# EasyEDA Pro project ProPrj_STM32F405RGT6机器人主控板_2024-12-01.epro, board PCB1
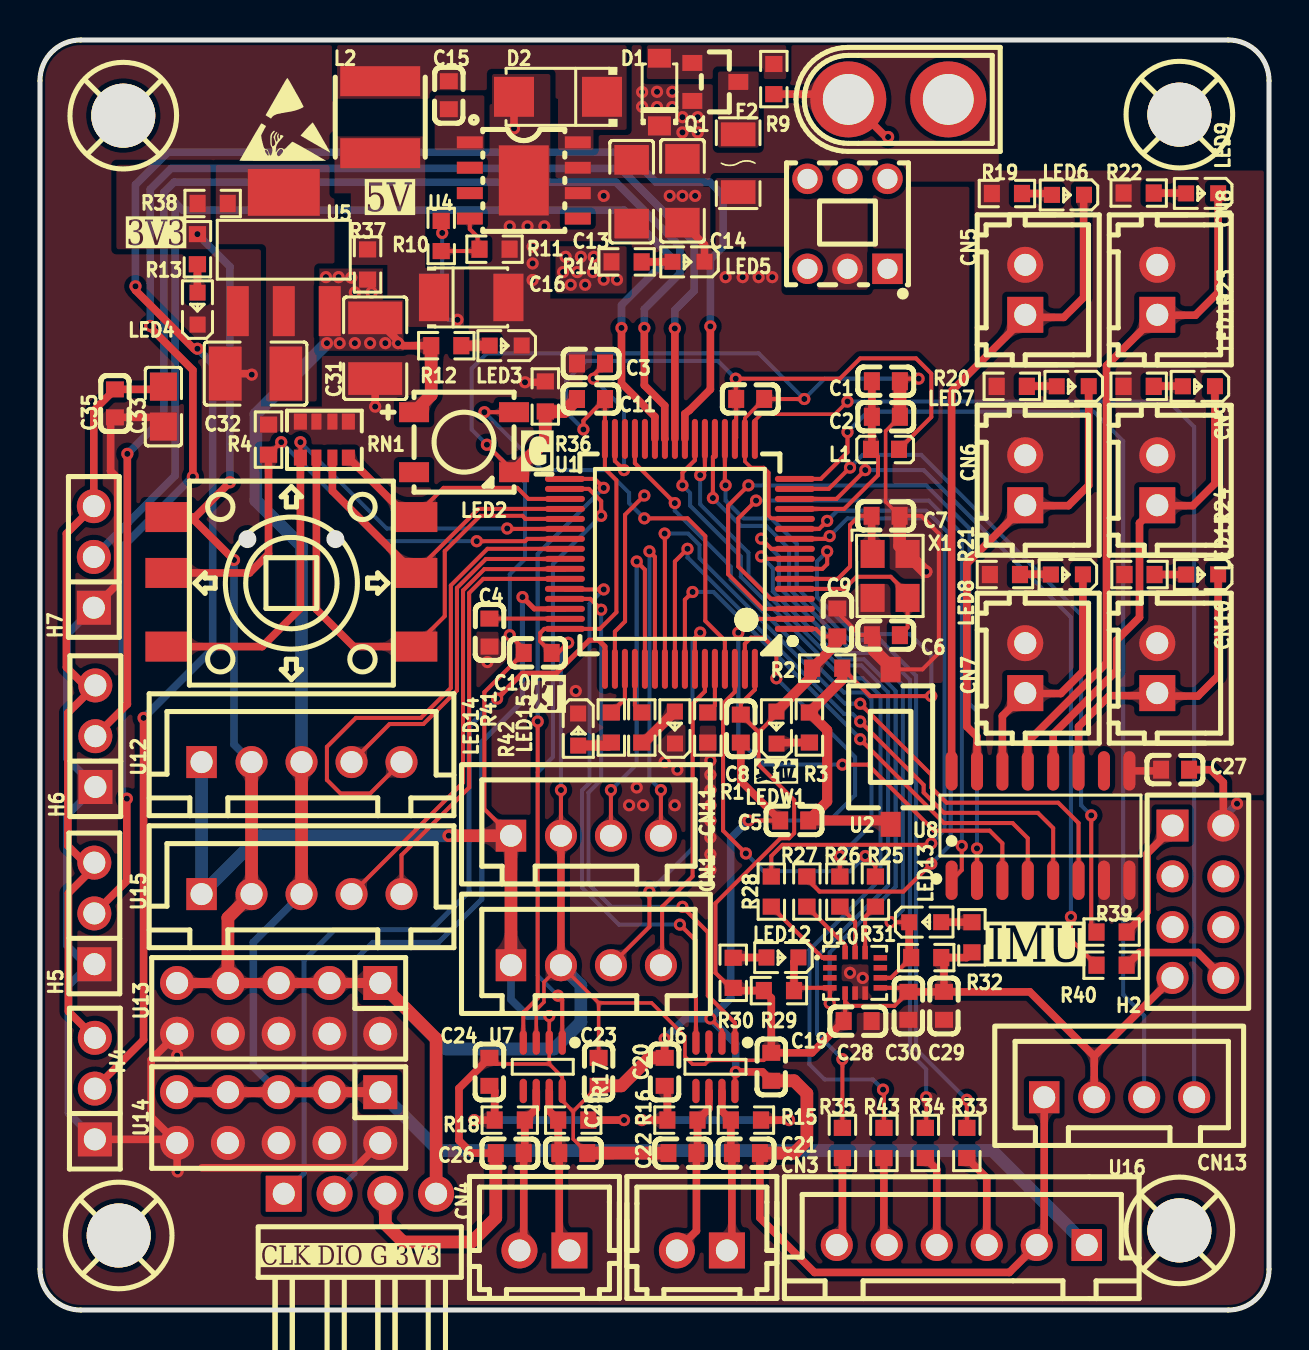
[diagram p3: board, top side]
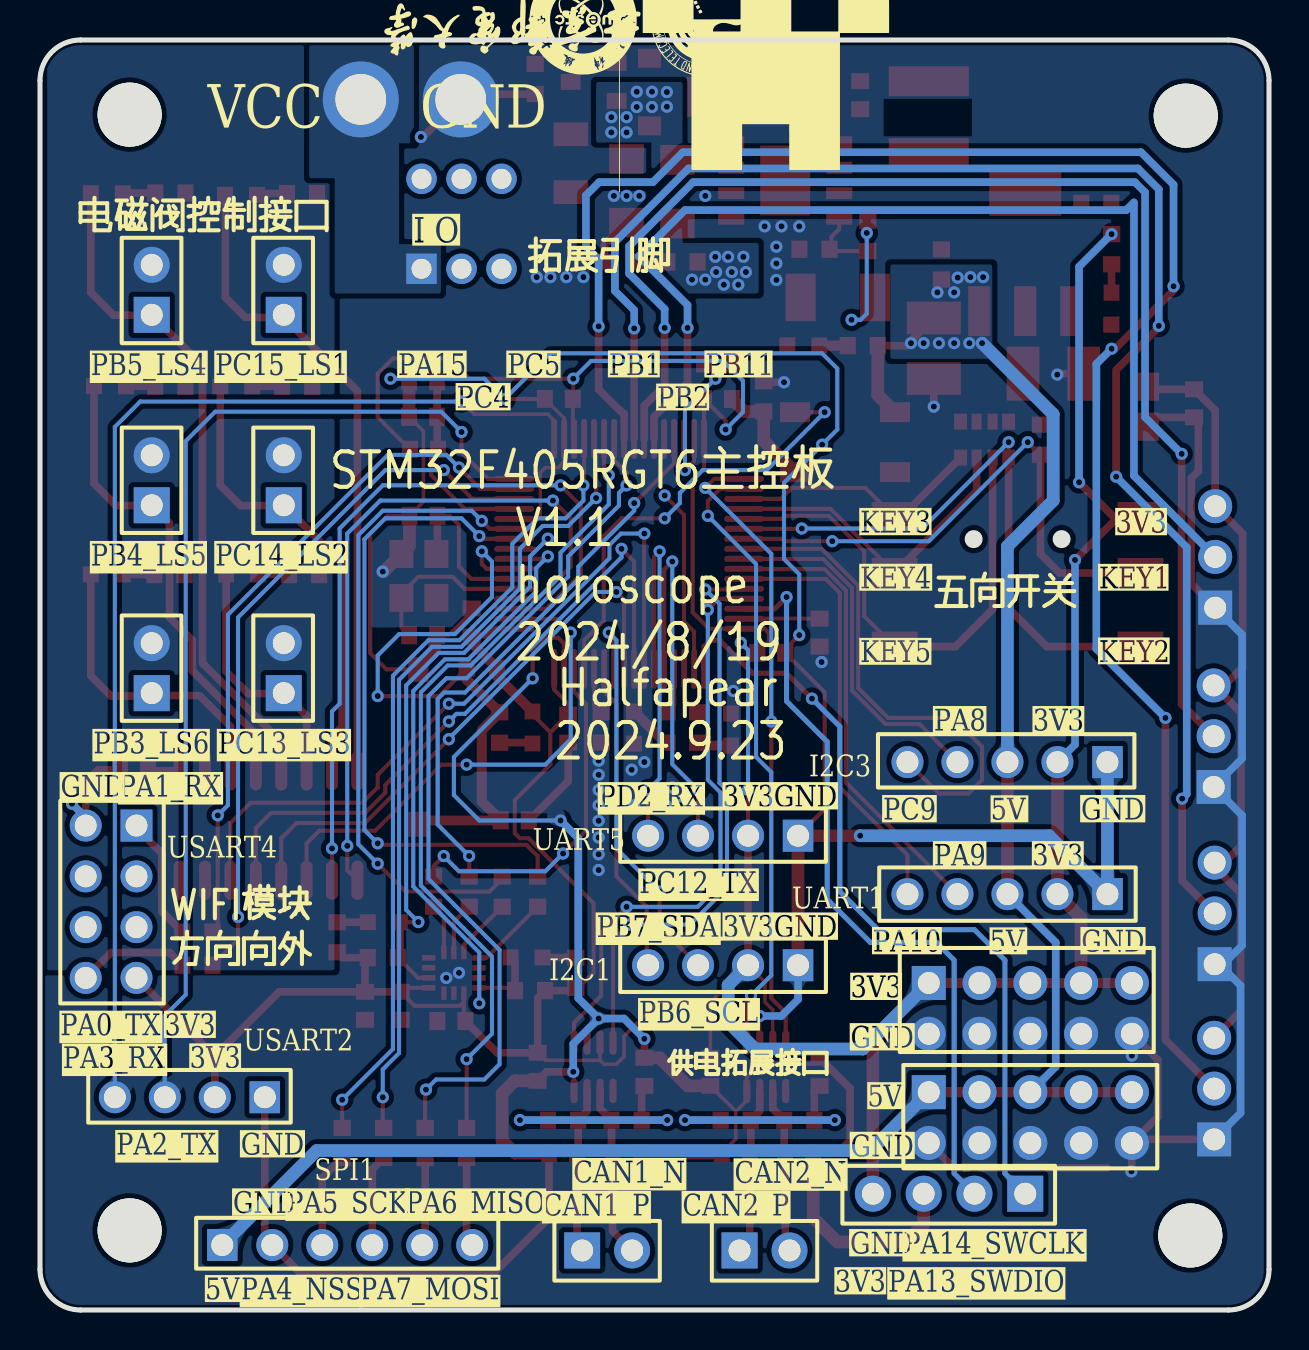
[diagram p4: board, bottom side, seen from below]

Outline 61.47 x 63.53 mm; copper layers: Top Layer, Bottom Layer. Coordinates in mm from the lower left corner of the outline.
Outline path: 0,61.49 0,2.03 arc(0.6,0.6) 2.03,0 59.44,0 arc(60.87,0.6) 61.47,2.03 61.47,61.49 arc(60.87,62.93) 59.44,63.53 2.03,63.53 arc(0.6,62.93) 0,61.49
Stack: Top Layer 0.035mm / Dielectric1 1.51mm FR4 er 4.5 / Bottom Layer 0.035mm

## Design rules (mm)
template: 自定义配置
spacing copperThickness1oz (default): track to track 0.102, other pairs 0.152 to 0.3
spacing copperThickness2oz: track to track 0.203, other pairs 0.152 to 0.3
track width copperThickness1oz (default): min 0.127, default 0.254, max 2.54
track width copperThickness2oz: min 0.203, default 0.254, max 2.54
differential pair differentialPair (default): width min 0.127, default 0.254, max 2.54; gap min 0.152, default 0.152
via viaSize (default): diameter min 0.5, default 0.61, max 10; hole min 0.3, default 0.305, max 6.299
net AGND uses copperRegion1
net 3V3 uses copperRegion1
net GND uses copperRegion1
net +5V uses copperRegion1
net VIN uses copperRegion1
net $2N592 uses copperRegion1
net VOUT uses copperRegion1
net $2N681 uses copperRegion1
net $2N1442 uses copperRegion1
net $2N1785 uses copperRegion1
net $2N1445 uses copperRegion1
net $2N1741 uses copperRegion1
net $2N2095 uses copperRegion1
net $2N9009 uses copperRegion1

## Placement (name value [footprint] x y rotation side)
C1  10nF  [C0603]  42.31 46.46 0 top
C2  1uF  [C0603]  42.31 44.68 0 top
C3  2.2uF  [C0603]  27.56 47.35 180 top
C4  2.2uF  [C0603]  22.48 33.88 270 top
C5  100nF  [C0603]  37.72 24.49 0 top
C6  22pF  [C0603]  42.31 33.76 0 top
C7  22pF  [C0603]  42.29 39.73 180 top
C8  100nF  [C0603]  35.05 29.08 90 top
C9  100nF  [C0603]  39.88 34.39 270 top
C10  100nF  [C0603]  24.89 32.87 0 top
C11  100nF  [C0603]  27.56 45.57 0 top
C12  100nF  [C0603]  35.52 45.57 180 top
C13  4.7uF  [C1206]  29.59 55.94 90 top
C14  4.7uF  [C1206]  32.13 55.98 90 top
C15  10nF  [C0603]  20.45 60.76 90 top
C16  220uF  [CASE-B_3528]  21.56 50.65 0 top
C19  100nF  [C0603]  36.58 12.17 90 top
C20  4.7nF  [C0603]  31.24 11.91 90 top
C21  100pF  [C0603]  35.31 7.85 180 top
C22  100pF  [C0603]  32.13 7.85 180 top
C23  100nF  [C0603]  27.94 11.91 90 top
C24  4.7nF  [C0603]  22.48 11.91 90 top
C25  100pF  [C0603]  26.67 7.85 180 top
C26  100pF  [C0603]  23.5 7.85 180 top
C27  100nF  [C0603]  56.77 27.03 0 top
C28  100nF  [C0603]  40.89 14.45 180 top
C29  2.2uF  [C0603]  45.21 15.21 90 top
C30  10nF  [C0603]  43.43 15.21 90 top
C31  10uF  [C1210]  16.76 48.11 90 top
C32  10uF  [C1210]  10.78 46.84 0 top
C33  100nF  [C0805]  6.17 45.19 90 top
C35  1uF  [C0603]  3.75 45.35 90 top
CN1  I2C1  [CONN-TH_4P-P2.50_4PIN]  27.31 17.25 0 top
CN2  XT30U-M  [CONN-TH_XT30U-M]  42.93 60.55 180 top
CN3  ZX-XH2.54-2PZZ  [CONN-TH_2P-P2.50_HX25003-2A]  33.1 2.98 180 top
CN4  ZX-XH2.54-2PZZ  [CONN-TH_2P-P2.50_HX25003-2A]  25.23 2.98 180 top
CN5  ZX-XH2.54-2PZZ  [CONN-TH_2P-P2.50_HX25003-2A]  49.28 51.03 90 top
CN6  ZX-XH2.54-2PZZ  [CONN-TH_2P-P2.50_HX25003-2A]  49.28 41.5 90 top
CN7  ZX-XH2.54-2PZZ  [CONN-TH_2P-P2.50_HX25003-2A]  49.28 32.11 90 top
CN8  ZX-XH2.54-2PZZ  [CONN-TH_2P-P2.50_HX25003-2A]  55.88 51.03 90 top
CN9  ZX-XH2.54-2PZZ  [CONN-TH_2P-P2.50_HX25003-2A]  55.88 41.5 90 top
CN10  ZX-XH2.54-2PZZ  [CONN-TH_2P-P2.50_HX25003-2A]  55.88 32.11 90 top
CN11  UART5  [CONN-TH_4P-P2.50_4PIN]  27.31 23.72 0 top
CN13  UART2  [CONN-TH_4P-P2.50_4PIN]  53.97 10.64 0 top
D1  MM1Z5V1  [SOD-123_L2.8-W1.8-LS3.7-RD]  30.98 60.92 90 top
D2  B340A  [SMA_L4.3-W2.6-LS5.1-RD]  25.91 60.68 180 top
F2  MF-NSMF020-2  [F1206]  34.92 57.36 90 top
H1  2.54-1*4P反弯排针  [HDR-TH_4P-P2.54-H-M-W10.4]  16 5.82 0 top
H2  PM254V-12-08-H85  [HDR-TH_8P-P2.54-V-F-R2-C4-S2.54]  57.91 20.42 270 top
H4  PZ254V-11-03P  [HDR-TH_3P-P2.54-V-M]  2.74 11.07 90 top
H5  PZ254V-11-03P  [HDR-TH_3P-P2.54-V-M]  2.72 19.84 90 top
H6  PZ254V-11-03P  [HDR-TH_3P-P2.54-V-M]  2.77 28.7 90 top
H7  PZ254V-11-03P  [HDR-TH_3P-P2.54-V-M]  2.69 37.67 90 top
L1  120R@100MHz  [L0603]  42.26 43.05 180 top
L2  22uH  [IND-SMD_L4.0-W4.0_LQH44PN2R2MP0L]  17.02 59.66 270 top
LED2  WS2812B  [LED-SMD_4P-L5.0-W5.0-BL_XL-5050RGBC]  21.21 43.41 270 top
LED3  -  [LED_0603]  23.24 48.23 180 top
LED4  -  [LED_0603]  7.87 50.14 90 top
LED5  -  [LED_0603]  32.38 52.43 180 top
LED6  -  [LED_0603]  51.36 55.77 180 top
LED7  -  [LED_0603]  51.6 46.2 180 top
LED8  -  [LED_0603]  51.31 36.78 180 top
LED9  -  [LED_0603]  58.07 55.85 180 top
LED10  -  [LED_0603]  57.91 46.2 180 top
LED11  -  [LED_0603]  58.07 36.78 180 top
LED12  -  [LED_0603]  37.08 17.63 180 top
LED13  -  [LED_0603]  44.32 19.41 0 top
LED14  -  [LED_0603]  26.92 28.98 270 top
LED15  -  [LED_0603]  31.75 29.18 90 top
LEDW1  -  [LED_0603]  36.83 29.18 90 top
Q1  AO3401A  [SOT-23_L2.9-W1.3-P1.90-LS2.4-BR]  33.78 61.43 180 top
R1  100K  [R0603]  33.4 29.14 270 top
R2  10K  [R0603]  39.37 32.11 180 top
R3  1K  [R0603]  38.48 29.14 270 top
R4  100K  [R0603]  11.43 43.54 270 top
R9  10K  [R0603]  36.7 61.57 90 top
R10  10K  [R0603]  20.07 53.72 90 top
R11  3.24K  [R0603]  22.73 53.06 0 top
R12  2K  [R0603]  20.32 48.23 0 top
R13  1K  [R0603]  7.87 53.06 270 top
R14  10K  [R0603]  29.34 52.43 0 top
R15  60R  [R0603]  35.31 9.5 0 top
R16  60R  [R0603]  32.13 9.5 180 top
R17  60R  [R0603]  26.67 9.5 0 top
R18  60R  [R0603]  23.5 9.5 180 top
R19  20K  [R0603]  48.36 55.85 0 top
R20  20K  [R0603]  48.6 46.2 0 top
R21  20K  [R0603]  48.26 36.79 0 top
R22  20K  [R0603]  54.95 55.87 0 top
R23  20K  [R0603]  54.95 46.2 0 top
R24  20K  [R0603]  54.99 36.79 0 top
R25  22R  [R0603]  41.78 20.93 270 top
R26  22R  [R0603]  40 20.93 270 top
R27  22R  [R0603]  38.35 20.93 270 top
R28  22R  [R0603]  36.58 20.93 270 top
R29  10K  [R0603]  36.96 15.98 0 top
R30  1K  [R0603]  34.67 16.87 90 top
R31  10K  [R0603]  44.32 17.63 180 top
R32  1K  [R0603]  46.61 18.64 90 top
R33  22R  [R0603]  46.35 8.36 90 top
R34  22R  [R0603]  44.28 8.36 90 top
R35  22R  [R0603]  40.13 8.36 90 top
R36  0R  [R0603]  25.27 45.69 270 top
R37  0R  [R0603]  16.38 52.3 270 top
R38  0R  [R0603]  8.64 55.35 180 top
R39  0R  [R0603]  53.59 18.91 0 top
R40  0R  [R0603]  53.59 17.25 180 top
R41  10K  [R0603]  28.57 29.14 270 top
R42  10K  [R0603]  30.1 29.14 270 top
R43  22R  [R0603]  42.21 8.36 90 top
RN1  100kΩ  [RES-ARRAY-SMD_0603-8P-L3.2-W1.6-BL]  14.22 43.54 180 top
SCREW1  -  [M3螺丝]  4 3.66 0 top
SCREW2  -  [M3螺丝]  4.23 59.68 0 top
SCREW3  -  [M3螺丝]  57.05 3.92 0 top
SCREW4  -  [M3螺丝]  57.05 59.73 0 top
SW2  五向开关  [SW-SMD_K1-1504SA-06]  12.57 36.42 0 top
SW3  5.8 ZSGT  [SW-TH_5.8ZSGT]  40.39 54.33 0 top
U1  STM32F405RGT6  [LQFP-64_L10.0-W10.0-P0.50-LS12.0-BL]  32 37.82 90 top
U2  GT-TC060A-H025-L1  [SW-SMD_L6.1-W3.5-LS8.0]  42.54 28.17 90 top
U4  TPS5430DDAR  [ESOP-8_L4.9-W3.9-P1.27-LS6.0-TL-EP]  24.2 56.5 0 top
U5  AMS1117-3.3  [SOT-223-3_L6.5-W3.4-P2.30-LS7.0-BR]  12.19 52.93 270 top
U6  MAX3051EKA+T  [SOT-23-8_L3.0-W1.7-P0.65-LS2.8-TL]  33.78 12.17 270 top
U7  MAX3051EKA+T  [SOT-23-8_L3.0-W1.7-P0.65-LS2.8-TL]  25.15 12.17 270 top
U8  ULN2003D1013TR  [SOIC-16_L9.9-W3.9-P1.27-LS6.0-BL]  50.04 24.23 0 top
U10  ICM-42688-P  [LGA-14_L3.0-W2.5-P0.50-TL]  40.77 16.87 0 top
U12  I2C3  [CONN-TH_5P-P2.50_ZX-XH2.54-5PZZ]  13.08 27.41 0 top
U13  ZX-PZ2.54-2-5PZZ  [HDR-TH_10P-P2.54-V-M-R2-C5-S2.54]  11.94 15.09 180 top
U14  ZX-PZ2.54-2-5PZZ  [HDR-TH_10P-P2.54-V-M-R2-C5-S2.54]  11.94 9.63 180 top
U15  I2C3  [CONN-TH_5P-P2.50_ZX-XH2.54-5PZZ]  13.08 20.8 0 top
U16  SPI1  [CONN-TH_6P-P2.50_ZX-XH2.54-6PZZ]  46.1 3.25 0 top
X1  25MHz  [OSC-SMD_4P-L3.2-W2.5-BL]  42.52 36.72 270 top

## Footprints (pads in the part's own frame, mm; a bottom-side part is the same pattern mirrored in y, then rotated)
C0603
  rect 0.8x0.9 smd: 1(-0.7,0) 2(0.7,0)
C0805
  rect 1.41x1.35 smd: 1(-1,0) 2(1,0)
C1206
  rect 1.485x1.728 smd: 1(-1.593,0) 2(1.593,0)
C1210
  rect 1.635x2.7 smd: 1(-1.518,0) 2(1.518,0)
CASE-B_3528
  rect 1.506x2.376 smd: 1(-1.861,0) 2(1.861,0)
CONN-TH_2P-P2.50_HX25003-2A
  rect 1.8x1.8 hole 1.1: 1(-1.25,0)
  round 1.8 hole 1.1: 2(1.25,0)
CONN-TH_4P-P2.50_4PIN
  rect 1.524x1.6 hole 1.1: 1(-3.75,0)
  round 1.6 hole 1.1: 2(-1.25,0) 3(1.25,0) 4(3.75,0)
CONN-TH_5P-P2.50_ZX-XH2.54-5PZZ
  rect 1.524x1.6 hole 1.1: 1(-5,0)
  round 1.6 hole 1.1: 2(-2.5,0) 3(0,0) 4(2.5,0) 5(5,0)
CONN-TH_6P-P2.50_ZX-XH2.54-6PZZ
  rect 1.524x1.6 hole 1.1: 1(6.25,0)
  round 1.6 hole 1.1: 2(3.75,0) 3(1.25,0) 4(-1.25,0) 5(-3.75,0) 6(-6.25,0)
CONN-TH_XT30U-M
  round 3.8 hole 2.54: 1(-2.5,0) 2(2.5,0)
ESOP-8_L4.9-W3.9-P1.27-LS6.0-TL-EP
  rect 1.3x0.6 smd: 1(-2.7,1.905) 2(-2.7,0.635) 3(-2.7,-0.635) 4(-2.7,-1.905) 5(2.7,-1.905) 6(2.7,-0.635) 7(2.7,0.635) 8(2.7,1.905)
  rect 2.5x3.5 smd: 9(0,0)
F1206
  rect 1.19x1.728 smd: 1(-1.445,0) 2(1.445,0)
HDR-TH_3P-P2.54-V-M
  rect 1.7x1.7 hole 1.1: 1(-2.54,0)
  round 1.7 hole 1.1: 2(0,0) 3(2.54,0)
HDR-TH_4P-P2.54-H-M-W10.4
  rect 1.8x1.8 hole 1.1: 1(-3.81,0)
  round 1.8 hole 1.1: 2(-1.27,0) 3(1.27,0) 4(3.81,0)
HDR-TH_8P-P2.54-V-F-R2-C4-S2.54
  rect 1.6x1.6 hole 1.1: 1(-3.81,-1.27)
  round 1.6 hole 1.1: 2(-3.81,1.27) 3(-1.27,-1.27) 4(-1.27,1.27) 5(1.27,-1.27) 6(1.27,1.27) 7(3.81,-1.27) 8(3.81,1.27)
HDR-TH_10P-P2.54-V-M-R2-C5-S2.54
  rect 1.7x1.7 hole 1.1: 1(-5.08,-1.27)
  round 1.7 hole 1.1: 2(-5.08,1.27) 3(-2.54,-1.27) 4(-2.54,1.27) 5(0,-1.27) 6(0,1.27) 7(2.54,-1.27) 8(2.54,1.27) 9(5.08,-1.27) 10(5.08,1.27)
IND-SMD_L4.0-W4.0_LQH44PN2R2MP0L
  rect 1.5x4 smd: 1(-1.8,0) 2(1.8,0)
L0603
  rect 0.8x0.864 smd: 1(-0.7,0) 2(0.7,0)
LED-SMD_4P-L5.0-W5.0-BL_XL-5050RGBC
  rect 1x1.5 smd: 1(-1.5,-2.5) 2(1.5,-2.5) 3(1.5,2.5) 4(-1.5,2.5)
LED_0603
  rect 0.8x0.8 smd: 1(-0.851,-0.01) 2(0.75,-0.005)
LGA-14_L3.0-W2.5-P0.50-TL
  rect 0.675x0.28 smd: 1(-1.262,0.75) 2(-1.262,0.25) 3(-1.262,-0.25) 4(-1.262,-0.75) 8(1.262,-0.75) 9(1.262,-0.25) 10(1.262,0.25) 11(1.262,0.75)
  rect 0.28x0.675 smd: 5(-0.5,-1.012) 6(0,-1.012) 7(0.5,-1.012) 12(0.5,1.012) 13(0,1.012) 14(-0.5,1.012)
LQFP-64_L10.0-W10.0-P0.50-LS12.0-BL
  oval 0.3x2 smd: 1(-3.75,-5.75) 2(-3.25,-5.75) 3(-2.75,-5.75) 4(-2.25,-5.75) 5(-1.75,-5.75) 6(-1.25,-5.75) 7(-0.75,-5.75) 8(-0.25,-5.75) 9(0.25,-5.75) 10(0.75,-5.75) 11(1.25,-5.75) 12(1.75,-5.75) 13(2.25,-5.75) 14(2.75,-5.75) 15(3.25,-5.75) 16(3.75,-5.75) 33(3.75,5.75) 34(3.25,5.75) 35(2.75,5.75) 36(2.25,5.75) 37(1.75,5.75) 38(1.25,5.75) 39(0.75,5.75) 40(0.25,5.75) 41(-0.25,5.75) 42(-0.75,5.75) 43(-1.25,5.75) 44(-1.75,5.75) 45(-2.25,5.75) 46(-2.75,5.75) 47(-3.25,5.75) 48(-3.75,5.75)
  oval 2x0.3 smd: 17(5.75,-3.75) 18(5.75,-3.25) 19(5.75,-2.75) 20(5.75,-2.25) 21(5.75,-1.75) 22(5.75,-1.25) 23(5.75,-0.75) 24(5.75,-0.25) 25(5.75,0.25) 26(5.75,0.75) 27(5.75,1.25) 28(5.75,1.75) 29(5.75,2.25) 30(5.75,2.75) 31(5.75,3.25) 32(5.75,3.75) 49(-5.75,3.75) 50(-5.75,3.25) 51(-5.75,2.75) 52(-5.75,2.25) 53(-5.75,1.75) 54(-5.75,1.25) 55(-5.75,0.75) 56(-5.75,0.25) 57(-5.75,-0.25) 58(-5.75,-0.75) 59(-5.75,-1.25) 60(-5.75,-1.75) 61(-5.75,-2.25) 62(-5.75,-2.75) 63(-5.75,-3.25) 64(-5.75,-3.75)
M3螺丝
  round 3.2 hole 3.2: 1(-0.064,0.064)
OSC-SMD_4P-L3.2-W2.5-BL
  rect 1.4x1.2 smd: 1(-1.1,-0.875) 2(1.1,-0.875) 3(1.1,0.875) 4(-1.1,0.875)
R0603
  rect 0.806x0.864 smd: 1(-0.753,0) 2(0.753,0)
RES-ARRAY-SMD_0603-8P-L3.2-W1.6-BL
  rect 0.65x0.8 smd: 1(-1.2,-0.9) 4(1.2,-0.9) 5(1.2,0.9) 8(-1.2,0.9)
  rect 0.5x0.8 smd: 2(-0.4,-0.9) 3(0.4,-0.9) 6(0.4,0.9) 7(-0.4,0.9)
SMA_L4.3-W2.6-LS5.1-RD
  rect 2x2 smd: 1(-2.2,0) 2(2.2,0)
SOD-123_L2.8-W1.8-LS3.7-RD
  rect 0.95x1.15 smd: 1(-1.692,0) 2(1.692,0)
SOIC-16_L9.9-W3.9-P1.27-LS6.0-BL
  oval 0.602x1.971 smd: 1(-4.445,-2.736) 2(-3.175,-2.736) 3(-1.905,-2.736) 4(-0.635,-2.736) 5(0.635,-2.736) 6(1.905,-2.736) 7(3.175,-2.736) 8(4.445,-2.736) 9(4.445,2.736) 10(3.175,2.736) 11(1.905,2.736) 12(0.635,2.736) 13(-0.635,2.736) 14(-1.905,2.736) 15(-3.175,2.736) 16(-4.445,2.736)
SOT-23-8_L3.0-W1.7-P0.65-LS2.8-TL
  oval 1.222x0.364 smd: 1(-1.211,0.975) 2(-1.211,0.325) 3(-1.211,-0.325) 4(-1.211,-0.975) 5(1.211,-0.975) 6(1.211,-0.325) 7(1.211,0.325) 8(1.211,0.975)
SOT-23_L2.9-W1.3-P1.90-LS2.4-BR
  rect 1x0.8 smd: 1(1.15,-0.95) 2(1.15,0.95) 3(-1.15,0)
SOT-223-3_L6.5-W3.4-P2.30-LS7.0-BR
  rect 2.5x1.1 smd: 1(2.97,-2.3) 2(2.97,0) 3(2.97,2.3)
  rect 2.34x3.6 smd: 4(-2.97,0)
SW-SMD_K1-1504SA-06
  rect 2.3x1.5 smd: 1(-6.15,3.239) 2(-6.15,0.445) 3(-6.15,-3.239) 4(6.15,3.239) 5(6.15,0.445) 6(6.15,-3.239)
SW-SMD_L6.1-W3.5-LS8.0
  rect 1.25x1 smd: 1(-3.875,0) 2(3.875,0)
SW-TH_5.8ZSGT
  rect 1.524x1.524 hole 1: 1(2,-2.25)
  round 1.524 hole 1: 2(0,-2.25) 3(-2,-2.25) 4(2,2.25) 5(0,2.25) 6(-2,2.25)

## Nets
As in the schematic.

Pads without a net: H2 3 4 5 6; LED2 2; SCREW1 1; SCREW2 1; SCREW3 1; SCREW4 1; SW3 3 4 5 6; U4 2 3 5; U6 5; U7 5; U8 10; U10 2 3 10 11

## Via types
v1: diameter 0.61, hole 0.305, Top Layer to Bottom Layer, 175 vias

## Routing (per net, layer and track width the routed paths; a pad name or vN(x,y) marks a point on that pad's centre or on a via; arc(x,y) is an arc through that point)
3.3V: length 39.3
  Top Layer w0.381: H4.3 1.42,14.93 1.42,20.85 2.72,22.15 H5.3 2.23,22.38 1.4,23.22 1.4,29.87 H6.3 2.23,31.24 1.32,32.15 1.32,38.84 H7.3 2.69,44.99 C35.2 6.04,46.05 C33.2
3V3: length 231.8
  Top Layer w0.178: 27.94,15.36 30.59,15.36 32.26,13.69 32.26,12.67 32.64,12.29 33.26,12.29 33.46,12.49 ; 27.94,15.36 C23.2 ; 27.94,15.36 CN1.2 25.21,16.4 25.21,15.4 24.82,15.02 U7.3 ; U6.3 33.46,12.49 ; 33.46,12.49 36.2,12.49 C19.2
  Top Layer w0.203: L1.1 44.58,44.67 44.58,46.84 43.81,47.6 41.02,47.6 40,46.58 v1(34.8,46.58) 34.8,45.59 C12.2 34.82,43.63 U1.19 ; U10.5 40.27,15.41 ; 40.27,15.41 40.47,15.21 42.73,15.21 C30.2 43.23,16.12 U10.8 ; 40.27,15.41 40.27,14.53 C28.2 ; 28.25,45.56 C11.2 ; 28.25,45.56 U1.32 28.25,42.08 28.83,41.5 28.83,34.9 28,34.07 U1.48 25.22,34.07 25.02,33.87 25.02,33.44 C10.2 25.91,32.87 v1(26.42,33.38) ; 28.25,45.56 27.18,44.49 v1(27.18,44.04) ; LEDW1.2 36.83,29.79 35.94,28.89 ; C9.2 39.18,33.69 38.8,34.07 U1.1 ; CN11.2 v1(26.06,26.01) ; R30.1 34.54,16.11 33.78,16.87 33.78,20.34 37.03,23.6 37.47,23.6 37.72,23.85 37.72,25.5 35.94,27.28 35.94,28.89 ; U1.64 35.75,31.03 35.05,30.33 C8.2 35.94,28.89
  Top Layer w0.381: CN11.2 CN1.2 ; C29.2 49.5,15.91 52.72,12.69 ; C29.2 C30.2 ; C29.2 45.21,17.49 R31.1 46.35,17.63 R32.1 ; C28.2 38.61,12.87 C19.2 36.58,15.6 R29.1 34.81,15.98 R30.1 ; H2.7 52.72,12.69 ; 52.72,12.69 CN13.2 ; 7.56,39.66 7.76,39.66 v1(9.5,41.4) ; 7.56,39.66 6.42,39.66 ; 7.56,39.66 v1(9.7,37.52)
  Top Layer w0.508: LEDW1.2 38.62,31.72 R2.2 39.88,33.37 C9.2 ; U13.9 U13.7 U13.5 U13.3 U13.1
  Top Layer w0.635: U13.1 19.81,13.56 H1.4 ; U12.2 U15.2 9.4,19.62 U13.7
  Bottom Layer w0.203: v1(34.8,46.58) 33.91,47.47 27.31,47.47 26.31,46.48 26.31,44.91 v1(27.18,44.04) ; v1(26.42,33.38) 26.06,33.01 v1(26.06,26.01)
  Bottom Layer w0.381: v1(7.87,53.81) 9.5,52.19 v1(9.5,41.4) ; v1(9.7,37.52) 9.7,28.28 U12.2
  Bottom Layer w0.635: U13.1 20.32,13.06 25.7,13.06 27.05,14.4 27.05,16.25 CN1.2
+5V: length 97.1
  Top Layer w0.381: R12.1 18.15,48.23 C31.2
  Top Layer w0.508: v1(6.86,10.9) U14.7 U14.5 U14.3 U14.1
  Top Layer w0.635: LED2.1 19.57,45.77 R12.1 ; U15.3 U12.3
  Bottom Layer w0.381: U14.5 10.67,12.17 10.67,18.39 U15.3
  Bottom Layer w0.635: U12.3 13.08,38.2 10.79,40.49 10.79,44.81 v1(14.35,48.36) ; U16.1 47.63,7.98 19.94,7.98 U14.1
  vias: v1(14.3,51.66) v1(14.94,51.66) v1(14.99,48.36) v1(15.57,51.64) v1(15.75,50.9) v1(15.75,48.36) v1(16.51,48.36) v1(16.59,50.9) v1(17.27,48.36) v1(17.91,48.36)
AGND: length 247.4
  Top Layer w0.178: 25.47,12.31 22.79,12.31 C24.2 ; 25.47,12.31 v1(25.47,14.71) ; 25.47,12.31 26.12,11.66 U7.8 26.12,10.47 26.67,9.92 ; C23.1 26.67,9.94 26.67,9.92 ; C2.2 42.29,43.96 42.29,40.43 C7.1 ; 26.67,9.92 26.67,8.55 C25.1 ; v1(34.8,11.91) 34.76,11.87 U6.8 ; v1(33.53,14.58) 34.11,14 34.11,13.38 ; U1.12 37.73,39.6 36.58,39.6 36.45,39.73 36.45,41.88 36.19,42.14 35.56,42.14 35.25,42.44 U1.18 35.25,44.61 C12.1
  Top Layer w0.203: v1(43.94,46.58) 43.13,46.58 C1.2 ; LED2.3 22.35,43.27 v1(22.35,43.28) ; C6.1 41.02,33.76 39.88,34.9 C9.1 ; U1.63 35.25,33.32 35.56,33.63 36.19,33.63 36.83,32.99 v1(36.83,31.6) ; CN11.1 22.23,25.05 22.23,30.9 C10.1 24.19,33.06 v1(23.5,33.76) ; C7.1 44.07,39.73 44.96,38.84 44.96,32.87 44.13,32.04 U2.2 ; C12.1 36.22,45.57 v1(38.23,45.57) ; v1(35.43,24.49) C5.1
  Top Layer w0.381: C5.1 35.05,26.45 C8.1 ; C20.2 v1(31.24,13.56) ; v1(34.8,11.91) 36.13,11.91 C19.1 ; CN13.1 50.22,3.62 U16.2 48.48,1.88 38.73,1.88 36.01,4.61 C21.1 ; C26.2 21.59,7.85 20.95,8.48 20.95,11.09 C24.2
  Top Layer w0.635: C19.1 37.72,11.47 38.35,10.83 38.35,8.48 37.72,7.85 C21.1 ; C23.1 29.07,11.21 30.47,12.61 C20.2 ; H1.3 17.27,4.29 18.16,3.4 21.59,3.4 22.79,4.61 C26.2 ; v1(20.45,23.72) CN11.1 CN1.1 ; LED2.3 25.27,43.47 R36.2 26.23,44.94 C11.1 ; C7.1 42.99,38.22 X1.4 44.28,36.93 44.32,36.93 ; U2.2 42.54,32.17 41.73,32.99 41.73,33.64 C6.1 ; C1.2 C2.2 ; C25.1 C22.2
  Bottom Layer w0.203: v1(23.5,33.76) 23.5,36.8 24.26,37.57 24.26,41.38 v1(22.35,43.28) 21.59,44.04 21.59,47.09 22.35,47.85 35.94,47.85 v1(38.23,45.57) 39.24,46.58 v1(43.94,46.58) ; v1(35.43,24.49) 39.5,24.49 40.77,25.76 40.77,27.66 v1(36.83,31.6)
  Bottom Layer w0.381: v1(35.43,24.49) 34.54,23.6 34.54,15.6 v1(33.53,14.58) ; v1(34.8,11.91) 34.8,13.31 v1(33.53,14.58) ; CN1.1 23.56,15.54 24.38,14.71 v1(25.47,14.71) ; v1(33.53,14.58) 32.26,14.58 v1(31.24,13.56)
  Bottom Layer w0.635: U12.1 v1(8.08,20.8) 11,23.72 v1(20.45,23.72)
  vias: v1(44.32,36.93)
GND: length 85.9
  Top Layer w0.381: C14.1 33.24,53.28 LED5.1 ; C33.1 5.71,44.65 C35.1 3.53,44.43 3.53,41.96 3.89,41.6 3.89,36.32 H7.1 ; v1(6.86,12.73) v1(6.86,13.82) 5.56,12.52 5.56,9.65 6.68,8.53 ; D2.2 v1(23.71,59.11) ; v1(42.42,58.67) 42.31,58.67 CN2.2 40.16,60.82 R9.1 ; C31.1 v1(16.76,45.19) ; v1(10.59,46.79) 10.54,46.84 C32.1 ; R36.1 25.23,46.41 v1(24.26,46.41) ; C27.2 58.55,27.03 59.18,26.39 H2.2 ; U14.2 15.77,7.11 8.1,7.11 ; 6.68,8.53 U14.10 6.86,6.96 v1(6.88,6.93) ; 6.68,8.53 H4.1 ; v1(59.87,25.32) 59.97,25.32
  Bottom Layer w0.381: 2.69,17.5 1.42,16.23 1.42,9.85 H4.1 ; 2.69,17.5 2.08,17.5 1.35,18.24 1.35,24.74 H6.1 1.35,27.58 1.35,33.78 H7.1 ; 2.69,17.5 2.72,17.47 H5.1 ; H2.2 59.18,24.64 v1(59.87,25.32) ; v1(23.71,59.11) 23.75,59.11
  vias: v1(22.38,32.41) v1(23.5,54.2) v1(24.38,54.2) v1(24.64,53.19) v1(24.64,52.35) v1(24.64,51.52) v1(25.23,54.2) v1(26.8,30.96) v1(28.19,55.73) v1(29.46,25.25) v1(29.84,26.14) v1(30.16,25.25) v1(31.24,27.41) v1(31.5,55.73) v1(31.75,25.25) v1(31.88,27.03) v1(32.13,55.73) v1(32.77,55.73) v1(33.53,27.48) v1(33.53,26.77) v1(33.53,26.01) v1(33.53,25.25) v1(33.53,24.47) v1(33.53,23.64) v1(33.53,22.8) v1(33.53,22.01) v1(34.29,51.66) v1(35.14,51.66) v1(35.94,51.66) v1(36.62,51.66) v1(40.51,16.87) v1(41.15,16.61)
AP_CS: length 2.5
  Top Layer w0.203: U10.12 41.27,19.66 R25.2
AP_SCLK: length 2.6
  Top Layer w0.203: U10.13 40.77,19.41 R26.2
AP_SDI: length 3.1
  Top Layer w0.203: R27.2 40.27,18.26 U10.14
AP_SDO: length 4
  Top Layer w0.203: R28.2 39.14,17.62 U10.1
CAN1_N: length 8.6
  Top Layer w0.381: U6.6 33.46,10.07 R16.1 32.88,7.9 C22.1 32.83,3.96 CN3.2
CAN1_P: length 8.3
  Top Layer w0.381: CN3.1 34.61,3.23 C21.2 34.55,7.9 R15.1 34.11,9.95 34.11,10.96
CAN2_N: length 8.3
  Top Layer w0.381: U7.6 24.82,10.07 R18.1 24.25,7.9 C26.1 24.19,3.19 CN4.2
CAN2_P: length 8.4
  Top Layer w0.381: 25.47,10.96 25.47,9.95 R17.1 25.92,7.9 C25.2 25.97,3.49 CN4.1
ENC1-CLK: length 4.6
  Top Layer w0.381: R34.1 44.85,7.03 U16.4
ENC1-CS: length 4.8
  Top Layer w0.381: U16.3 47.35,6.61 R33.1
ENC1-DI: length 4.4
  Top Layer w0.381: U16.5 42.21,3.4 R43.1
ENC1-DO: length 4.5
  Top Layer w0.381: R35.1 40.13,3.53 U16.6
LS1: length 32.7
  Top Layer w0.381: LED6.1 52.2,55.77 52.2,50.65 51.2,49.65 49.28,49.65 45.59,45.97 U8.16
LS2: length 23.3
  Top Layer w0.381: 52.45,46.2 52.45,41.25 51.44,40.23 49.3,40.23 CN6.1 46.35,37.33 46.35,29.18 46.86,28.68 46.86,26.97
LS3: length 12.6
  Top Layer w0.381: U8.14 48.13,29.71 CN7.1 49.3,30.84 51.05,30.84 52.16,31.94 52.16,36.81
LS4: length 34
  Top Layer w0.381: LED9.1 58.92,50.9 57.78,49.76 55.9,49.76 CN8.1 53.34,47.24 53.34,32.36 49.4,28.42 U8.13
LS5: length 23.7
  Top Layer w0.381: U8.12 50.67,28.8 53.85,31.98 53.85,33.5 54.99,34.65 54.99,39.36 CN9.1 55.9,40.23 57.66,40.23 58.76,41.34 58.76,46.21
LS6: length 15.3
  Top Layer w0.381: U8.11 51.94,29.18 53.49,30.73 55.88,30.73 55.9,30.71 57.91,30.71 58.92,31.72 58.92,36.8
NRST: length 32.1
  Top Layer w0.203: R2.1 41.52,30.71 v1(44.58,30.71) ; U1.7 39.13,37.07 39.37,37.31 v1(39.37,37.95)
  Top Layer w0.508: R2.1 40.12,31.53 R3.1 39.37,29 39.37,25.44 C5.2 42.35,24.49 U2.1
  Bottom Layer w0.203: v1(39.37,37.95) 38.86,37.44 38.86,35.66 40.72,33.81 43.51,33.81 44.58,32.74 v1(44.58,30.71)
PA0-UART4_TX: length 35.4
  Top Layer w0.203: v1(41.28,42.01) 39.83,40.57 U1.14 ; v1(51.56,19.66) 51.56,18.52 R40.2
  Bottom Layer w0.203: v1(51.56,19.66) 51.56,34.65 44.2,42.01 v1(41.28,42.01)
PA1-UART4_RX: length 34.5
  Top Layer w0.203: v1(52.58,24.74) 52.58,19.17 R39.1 ; U1.15 39.44,41.07 v1(40.51,42.14)
  Bottom Layer w0.203: v1(40.51,42.14) 41.15,42.77 44.07,42.77 52.07,34.77 52.07,25.25 v1(52.58,24.74)
PA2-USART2_TX: length 52.3
  Top Layer w0.203: v1(40.39,43.92) 40.39,42.9 39.06,41.57 U1.16
  Bottom Layer w0.203: CN13.3 55.22,14.73 54.18,15.77 54.18,43.46 52.7,44.93 41.4,44.93 v1(40.39,43.92)
PA3-USART2_RX: length 57.3
  Top Layer w0.178: U1.17 35.75,44.49 36.07,44.81 39.75,44.81 v1(40.39,45.44)
  Bottom Layer w0.203: CN13.4 57.72,44.17 56.45,45.44 v1(40.39,45.44)
PA4-SPI1_NSS: length 41.2
  Top Layer w0.203: U1.20 34.25,41.29 v1(34.29,41.25) ; v1(46.35,10.52) R33.2
  Bottom Layer w0.203: v1(34.29,41.25) 34.29,40.49 35.18,39.6 36.58,39.6 37.85,38.33 37.85,36.14 40.49,33.5 42.04,33.5 43.81,31.72 43.81,13.06 v1(46.35,10.52)
PA5-SPI1_SCK: length 40.5
  Top Layer w0.203: R34.2 44.32,9.15 v1(44.32,10.64) ; U1.21 33.75,42.77 33.66,42.67 v1(33.66,40.61)
  Bottom Layer w0.203: v1(33.66,40.61) 35.05,39.22 36.32,39.22 37.47,38.07 37.47,36.09 40.39,33.17 41.86,33.17 43.51,31.52 43.51,12.85 44.32,12.04 v1(44.32,10.64)
PA6-SPI1_MISO: length 41.1
  Top Layer w0.203: U1.22 33.25,41.99 v1(33.02,41.76) ; v1(40.13,12.55) R35.2
  Bottom Layer w0.203: v1(40.13,12.55) 38.86,13.82 38.86,17.68 42.42,21.23 42.42,30.9 41.08,32.24 39.92,32.24 35.43,36.73 35.43,37.88 33.02,40.3 v1(33.02,41.76)
PA7-SPI1_MOSI: length 43.8
  Top Layer w0.203: v1(32.13,41.25) 32.13,41.88 32.75,42.51 U1.23 ; v1(42.16,11.02) 42.21,10.98 R43.2
  Bottom Layer w0.203: v1(32.13,41.25) 32.51,40.87 32.51,40.23 35.05,37.69 35.05,36.68 40.13,31.6 41.15,31.6 42.04,30.71 42.04,21.56 38.48,18.01 38.48,12.29 39.24,11.53 41.66,11.53 v1(42.16,11.02)
PA8_I2C3_SCL: length 17.9
  Top Layer w0.203: U12.4 17.49,29.31 19.18,29.31 20.85,30.99 20.85,36.12 22.3,37.57 26.25,37.57 U1.41
PA9-USART1_TX: length 23
  Top Layer w0.203: U1.42 26.24,37.06 22.22,37.06 21.16,35.99 21.16,26.38 U15.4
PA10-USART1_RX: length 21.5
  Top Layer w0.203: U15.5 18.08,22.75 21.46,26.14 21.46,35.87 22.17,36.57 U1.43
PA11-CAN1_RX: length 29.2
  Top Layer w0.203: U1.44 26.28,36.04 v1(28.19,36.04) ; v1(32,19.28) 32.81,18.48 U6.4
  Bottom Layer w0.203: v1(28.19,36.04) 27.48,35.33 27.48,26.37 27.11,25.99 27.11,21.13 28.96,19.28 v1(32,19.28)
PA12-CAN1_TX: length 29.1
  Top Layer w0.203: U1.45 27.52,35.57 v1(28.07,35.03) ; U6.1 34.76,14.37 33.4,15.72 33.4,18.9 v1(32.13,20.17)
  Bottom Layer w0.203: v1(32.13,20.17) 28.57,20.17 27.43,21.31 27.43,25.88 28.07,26.52 v1(28.07,35.03)
PA13_JTMS/SWDIO: length 38
  Top Layer w0.254: U1.46 24.72,35.07 v1(24.13,35.66)
  Bottom Layer w0.254: v1(24.13,35.66) 24.13,30.45 22.1,28.42 22.1,20.55 19.94,18.39 16.64,18.39 15.75,17.5 15.75,6.83 H1.2
PA14_JTCK/SWCLK: length 39.9
  Top Layer w0.254: U1.49 28.25,33.19 27.94,33.5 27.47,33.5 25.82,31.85 24.13,31.85 v1(22.86,30.58)
  Bottom Layer w0.254: H1.1 13.21,6.83 13.21,17.5 14.73,19.02 19.56,19.02 21.46,20.93 21.46,29.18 v1(22.86,30.58)
PA15(JTDI): length 9.3
  Top Layer w0.203: U1.50 28.75,33.94 29.26,34.44 29.26,39.78 v1(30.23,40.74)
PB0: length 66.8
  Top Layer w0.381: H6.2 4.37,30.3 v1(4.37,42.82) ; v1(30.23,49.12) 30.23,46.25 31.25,45.23 31.25,43.58 U1.26
  Bottom Layer w0.381: v1(4.37,42.82) 6.2,44.65 6.2,55.91 6.71,56.41 28.8,56.41 32,53.21 32,51.84 30.23,50.06 v1(30.23,49.12)
PB1: length 56.1
  Top Layer w0.381: v1(29.08,49.12) 29.08,46.35 30.75,44.68 U1.27
  Bottom Layer w0.381: v1(29.08,49.12) 29.08,50.27 31.52,52.7 29.21,55.02 7.14,55.02 6.76,55.4 6.76,41.73 H7.2
PB3-CYL6: length 37.1
  Top Layer w0.203: U1.55 31.25,38.82 v1(31.24,38.84) ; v1(41.02,30.33) 44.58,26.77 44.58,26.14 45.34,25.37 50.93,25.37 51.94,24.36 U8.6
  Bottom Layer w0.203: v1(41.02,30.33) 40.26,30.33 32.99,37.6 32.99,38.26 32.41,38.84 v1(31.24,38.84)
PB4-CYL5: length 33.4
  Top Layer w0.203: U1.56 31.75,37.44 v1(32.38,38.07) ; U8.5 50.67,24.1 49.91,24.87 45.21,24.87 44.2,25.88 44.2,26.26 v1(41.02,29.44)
  Bottom Layer w0.203: v1(32.38,38.07) 32.38,37.64 40.21,29.82 40.64,29.82 v1(41.02,29.44)
PB5-CYL4: length 28
  Top Layer w0.203: v1(32.64,35.92) 32.25,35.53 U1.57 ; v1(41.02,28.55) 45.21,24.36 48.64,24.36 49.4,23.6 U8.4
  Bottom Layer w0.203: v1(32.64,35.92) 33.68,35.92 41.02,28.58 v1(41.02,28.55)
PB6-I2C1_SCL: length 20.4
  Top Layer w0.203: U1.58 32.75,33.62 v1(33.02,33.88) ; v1(30.48,20.93) 30.48,19.17 CN1.3
  Bottom Layer w0.203: v1(33.02,33.88) 32.64,33.5 32.64,23.09 v1(30.48,20.93)
PB7-I2C1_SDA: length 15.7
  Top Layer w0.203: CN1.4 31.11,17.31 31.11,20.17 32.64,21.69 32.64,30.33 33.25,30.94 U1.59
PB8_RGB: length 22.4
  Top Layer w0.203: LED2.4 v1(22.22,44.91) ; U1.61 34.25,33.49 33.27,34.47 33.27,38.71 32.38,39.6 v1(30.23,39.6)
  Bottom Layer w0.203: v1(30.23,39.6) 29.46,40.36 29.46,40.87 28.32,42.01 25.12,42.01 v1(22.22,44.91)
PB9-SPI2_NSS: length 17.8
  Top Layer w0.203: U1.62 34.75,30.92 34.16,30.33 34.16,23.98 v1(35.31,22.83) ; R25.1 41.78,22.2 v1(41.28,22.71)
  Bottom Layer w0.203: v1(41.28,22.71) 40.51,21.95 36.19,21.95 v1(35.31,22.83)
PB10-SPI2_SCK: length 28.1
  Top Layer w0.203: U1.29 29.75,42.36 v1(31.75,40.36) ; v1(40,22.71) R26.1
  Bottom Layer w0.203: v1(31.75,40.36) 31.75,39.98 34.54,37.19 34.54,36.55 40.21,30.89 41.25,30.89 41.58,30.56 41.58,24.28 v1(40,22.71)
PB12-CAN2_RX: length 31.5
  Top Layer w0.203: U1.33 27.75,41.57 v1(28.19,41.12) ; v1(24.89,29.44) 24.89,15.6 24.17,14.87 U7.4
  Bottom Layer w0.203: v1(24.89,29.44) 24.89,37.82 v1(28.19,41.12)
PB13-CAN2_TX: length 31
  Top Layer w0.203: v1(25.91,15.72) 26.12,15.51 U7.1 ; v1(28.07,39.73) 28.07,40.46 27.46,41.07 U1.34
  Bottom Layer w0.203: v1(28.07,39.73) 25.65,37.31 25.65,27.66 24.89,26.9 24.89,16.74 v1(25.91,15.72)
PB14_KEY3: length 12.9
  Top Layer w0.203: U1.35 24.43,40.57 23.88,41.12 20.18,41.12 SW2.4
  Top Layer w0.381: SW2.4 18.4,39.66 RN1.8
PB15_KEY4: length 16.3
  Top Layer w0.203: U1.36 21.93,40.07 SW2.5
  Top Layer w0.381: RN1.7 14.62,40.97 SW2.5
PC0-EXTI0_INT1: length 33.3
  Top Layer w0.203: R29.2 37.85,16.12 U10.4 39.5,15.35 v1(39.5,15.34) ; v1(36.07,37.69) 36.19,37.57 U1.8
  Top Layer w0.381: R29.2 37.71,17.41 LED12.1
  Bottom Layer w0.203: v1(39.5,15.34) 39.5,17.88 42.8,21.18 42.8,30.96 41.22,32.54 40.05,32.54 36.65,35.94 36.65,37.11 v1(36.07,37.69)
PC1-EXTI1_INT2: length 29.7
  Top Layer w0.203: U1.9 36.58,38.07 v1(36.07,38.58) ; R31.2 42.56,16.62 U10.9 ; v1(42.54,19.41) 42.56,19.4 LED13.1
  Top Layer w0.381: R31.2 43.47,17.72 LED13.1
  Bottom Layer w0.203: v1(42.54,19.41) 43.15,20.01 43.15,31.24 41.53,32.87 40.26,32.87 36.96,36.17 36.96,37.69 v1(36.07,38.58)
PC2-SPI2_MISO: length 33.1
  Top Layer w0.203: v1(44.58,23.34) 44.5,23.27 37.13,23.27 36.58,22.71 R28.1 ; v1(39.5,38.71) 39.36,38.57 U1.10
  Bottom Layer w0.203: v1(39.5,38.71) 40.39,39.6 44.2,39.6 45.24,38.55 45.24,24.01 v1(44.58,23.34)
PC3-SPI2_MOSI: length 32.7
  Top Layer w0.203: R27.1 38.35,21.56 38.99,20.93 43.18,20.93 v1(44.58,22.33) ; U1.11 38.97,39.07 v1(39.37,39.47)
  Bottom Layer w0.203: v1(39.37,39.47) 39.88,39.98 44.32,39.98 45.55,38.75 45.55,23.3 v1(44.58,22.33)
PC4: length 93.3
  Top Layer w0.381: v1(4.77,51.21) 4.77,51 7.7,48.08 v1(7.87,48.08) ; v1(33.53,49.2) 33.53,46.05 32.49,45.01 32.26,44.83 32.25,44.83 U1.24 ; v1(5.18,29.62) 5.18,13.51 H4.2
  Bottom Layer w0.381: v1(7.87,48.08) 8.64,47.32 8.64,33.07 v1(5.18,29.62) ; v1(4.77,51.21) 4.77,56.29 6.4,57.91 29.31,57.91 30.81,56.41 33.5,56.41 34.16,55.75 34.16,53.19 33.53,52.55 v1(33.53,49.2)
PC5: length 78.7
  Top Layer w0.381: v1(31.75,49.1) 31.75,49.09 U1.25 ; v1(5.51,49.22) 5.51,49.15 7.65,47.02 v1(7.65,41.68) ; v1(4.34,25.58) 4.34,21.46 H5.2
  Bottom Layer w0.381: v1(5.51,49.22) 5.51,56.06 6.55,57.1 29.03,57.1 32.72,53.42 32.72,50.98 31.75,50.01 v1(31.75,49.1) ; v1(4.34,25.58) 4.11,25.81 4.11,38.15 v1(7.65,41.68)
PC6_KEY5: length 25.5
  Top Layer w0.203: SW2.6 20.24,34.71 20.24,37.96 22.01,39.73 24.13,39.73 24.27,39.58 24.27,39.57 U1.37
  Top Layer w0.381: SW2.6 15.68,33.18 13.82,35.05 RN1.6
PC7_KEY2: length 30.7
  Top Layer w0.203: U1.38 23.39,39.07 v1(23.37,39.09) ; v1(13.02,43.41) RN1.5
  Top Layer w0.381: RN1.5 13.02,35.1 11.11,33.18 6.42,33.18
  Bottom Layer w0.203: v1(13.02,43.41) 17.34,39.09 v1(23.37,39.09)
PC8_KEY1: length 27.5
  Top Layer w0.203: v1(12.06,43.41) 12.06,43.41 R4.2 ; U1.39 24.37,38.57 24.26,38.46 v1(21.84,38.46)
  Top Layer w0.381: R4.2 11.43,37.82 10.48,36.87 6.42,36.87
  Bottom Layer w0.203: v1(12.06,43.41) 17.02,38.46 v1(21.84,38.46)
PC9_I2C3_SDA: length 25.3
  Top Layer w0.203: U1.40 26.25,38.07 22.38,38.07 20.55,36.24 20.55,31.11 19.05,29.62 15.8,29.62 14.35,28.17 14.35,26.52 15.03,25.84 16.51,25.84 U12.5
PC10: length 2.5
  Top Layer w0.203: U1.51 29.25,30.57 R41.1
PC11: length 2.3
  Top Layer w0.203: U1.52 29.75,30.23 R42.1
PC12-UART5_TX: length 19.8
  Top Layer w0.203: CN11.3 v1(28.56,26.01) ; v1(29.84,37.44) 30.25,37.03 U1.53
  Bottom Layer w0.203: v1(29.84,37.44) 29.84,27.3 v1(28.56,26.01)
PC13-CYL3: length 25.7
  Top Layer w0.203: U1.2 35.61,34.57 v1(34.92,33.88) ; v1(40.13,27.28) 41.4,27.28 44.7,23.98 47.5,23.98 48.13,23.34 U8.3
  Bottom Layer w0.203: v1(40.13,27.28) 36.19,27.28 34.92,28.55 v1(34.92,33.88)
PC14-CYL2: length 38.6
  Top Layer w0.203: v1(35.43,41.25) 34.42,40.23 34.42,36.8 36.15,35.07 U1.3 ; 46.86,21.5 v1(46.86,23.09)
  Bottom Layer w0.203: v1(46.86,23.09) 46.86,29.95 46.48,30.33 46.48,39.09 44.32,41.25 v1(35.43,41.25)
PC15-CYL1: length 35.7
  Top Layer w0.203: v1(46.1,23.22) 46.1,22 U8.1 ; v1(35.81,40.49) 34.92,39.6 34.92,37.19 36.54,35.57 U1.4
  Bottom Layer w0.203: v1(35.81,40.49) 44.45,40.49 46.1,38.84 v1(46.1,23.22)
PD2-UART5_RX: length 20.5
  Top Layer w0.203: CN11.4 v1(31.06,26.01) ; v1(30.48,37.95) 30.75,37.67 U1.54
  Bottom Layer w0.203: v1(30.48,37.95) 30.48,26.58 v1(31.06,26.01)
PH0-OSC_IN: length 8.5
  Top Layer w0.203: U1.5 40.23,36.07 40.84,36.68 42.54,36.68 43.39,35.83 43.39,34.14 C6.2
PH1-OSC_OUT: length 8.3
  Top Layer w0.203: U1.6 39.9,36.57 40.51,37.19 40.51,39.27 40.97,39.73 C7.2
  Top Layer w0.381: X1.1 41.59,37.87 C7.2
VOUT: length 1.6
  Top Layer w0.381: 56.07,27.03 56.01,26.97 54.48,26.97
  vias: v1(26.16,51.92) v1(26.29,52.68) v1(26.54,51.28) v1(26.87,51.92) v1(27.05,52.68) v1(27.27,51.28) v1(27.7,52.68) v1(27.65,51.92) v1(28.19,51.54) v1(28.86,51.54) v1(30.11,60.92) v1(30.11,60.19) v1(30.86,60.93) v1(30.86,60.17) v1(31.62,60.93) v1(31.62,60.17) v1(32.13,59.66) v1(32.13,58.9) v1(32.89,59.66) v1(32.89,58.9)
$1N1219: length 9.7
  Top Layer w0.203: L1.2 41.91,42.7 41.91,41.76 40.22,40.07 U1.13
  Top Layer w0.381: C1.1 C2.1 41.61,43.1 L1.2
$1N2057: length 2.3
  Top Layer w0.203: R1.1 33.75,30.24 U1.60
$1N2161: length 8
  Top Layer w0.203: v1(27.69,46.58) 27.69,46.77 C3.1 ; U1.31 28.75,42.47 v1(29.21,42.01)
  Bottom Layer w0.203: v1(27.69,46.58) 29.21,45.06 v1(29.21,42.01)
$1N2164: length 3.8
  Top Layer w0.203: U1.47 26.24,34.58 C4.1
$1N2341: length 1.7
  Top Layer w0.381: R3.2 36.89,28.38 LEDW1.1
$1N10699: length 1.7
  Top Layer w0.508: LED14.2 28.43,28.23 R41.2
$1N10726: length 2.3
  Top Layer w0.508: R42.2 30.2,28.38 LED15.2
$2N1741: length 5.5
  Top Layer w0.203: R10.2 20.07,53.92 v1(20.12,53.87)
  Bottom Layer w0.203: v1(20.88,49.53) 20.42,49.53 20.12,49.83 v1(20.12,53.87)
$2N1785: length 3.7
  Top Layer w0.203: 21.5,54.6 21.5,54.07 21.89,53.68 21.89,52.97 ; R10.1 21.89,52.97 ; 21.89,52.97 R11.1
$2N2279: length 1.4
  Top Layer w0.508: LED3.2 22.49,48.23 R12.2
$2N2306: length 1.4
  Top Layer w0.381: LED4.2 7.87,50.89 R13.2
$2N2333: length 1.5
  Top Layer w0.381: R14.2 31.63,52.43 LED5.2
$2N3054: length 11.8
  Top Layer w0.381: v1(30.1,9.5) R16.2 31.38,11.08 C20.1 ; v1(37.47,9.5) R15.2
  Bottom Layer w0.381: v1(37.47,9.5) v1(30.1,9.5)
$2N3588: length 12.1
  Top Layer w0.381: C24.1 22.74,10.95 R18.2 v1(21.72,9.5) ; R17.2 v1(29.21,9.5)
  Bottom Layer w0.381: v1(21.72,9.5) v1(29.21,9.5)
$2N4408: length 1.5
  Top Layer w0.381: R19.2 50.55,55.85 LED6.2
$2N4549: length 1.5
  Top Layer w0.381: 50.85,46.2 50.84,46.21 49.36,46.21
$2N4660: length 1.5
  Top Layer w0.381: 50.56,36.81 50.55,36.8 49.01,36.8
$2N4771: length 1.6
  Top Layer w0.381: LED9.2 57.31,55.87 R22.2
$2N4882: length 1.5
  Top Layer w0.381: 57.16,46.21 57.16,46.21 55.7,46.21
$2N4993: length 1.6
  Top Layer w0.381: LED11.2 57.32,36.79 R24.2
$2N7461: length 6.3
  Top Layer w0.381: H2.1 56.64,24.1 55.37,22.83 55.37,19.93 R39.2
$2N7487: length 5.6
  Top Layer w0.381: H2.8 57.91,17.88 54.98,17.88 R40.1
$3N791: length 1.7
  Top Layer w0.381: R30.2 34.68,17.63 36.33,17.63
$3N966: length 1.5
  Top Layer w0.381: R32.2 46.61,19.4 LED13.2

## Copper pours and planes (outline as drawn; the poured copper is in the pictures)
3V3 on Top Layer: 3.82,57.28 8.53,57.28 8.53,53.06 3.82,53.06
+5V on Top Layer: 13.97,52.1 18.18,52.1 18.18,47.98 13.97,47.98
+5V on Bottom Layer: 13.84,52.3 18.94,52.3 18.94,47.57 13.84,47.57
AGND on Top Layer: 38.95,41.07 45.24,41.07 45.24,31.37 38.95,31.37
AGND on Bottom Layer: 40.13,39.6 44.96,39.6 44.96,34.14 40.13,34.14
GND on Top Layer: 48.31,63.15 61.11,63.15 61.11,57.23 48.31,57.23
GND on Top Layer: 22.61,61.82 25.53,61.82 25.53,49.45 22.61,49.45
GND on Top Layer: -1.65,65 64.47,65 64.47,-1.32 -1.65,-1.32
GND on Top Layer: 8.63,50.04 8.63,53.06 11.05,53.06 11.05,45.19 14.73,45.19 14.73,47.6 18.41,47.6 18.41,45.7 17.27,45.7 17.27,43.8 7.11,43.8 7.11,50.04
GND on Top Layer: 24.89,56.36 33.18,56.36 33.18,53.46 24.89,53.46
GND on Bottom Layer: -3.43,66.4 66.19,66.4 66.19,-3.02 -3.43,-3.02
VIN on Bottom Layer: 42.77,63.82 42.77,58.35 43.51,58.35 43.51,53.31 41.41,53.31 41.41,50.85 46.73,50.85 46.73,56.62 48.01,56.62 48.01,63.82
VOUT on Top Layer: 46.74,57 61.54,57 61.54,25.76 46.74,25.76
VOUT on Top Layer: 25.53,53.46 29.34,53.46 29.34,50.85 25.53,50.85
VOUT on Top Layer: 25.53,63.76 47.95,63.76 47.95,56.44 25.53,56.44
VOUT on Bottom Layer: 46.74,64.24 61.11,64.24 61.11,16.99 46.74,16.99
VOUT on Bottom Layer: 29.34,61.43 29.34,53.37 25.53,53.37 25.53,50.85 30.89,50.85 30.89,58.39 33.66,58.39 33.66,61.43
$2N592 on Top Layer: 33.91,61.95 35.94,61.95 35.94,58.14 33.91,58.14
$2N681 on Top Layer: 30.35,63.86 37.32,63.86 37.32,61.57 30.35,61.57
$2N1442 on Top Layer: 19.74,60.76 22.22,60.76 22.22,58.01 19.74,58.01
$2N1445 on Top Layer: 14.86,63.98 14.86,60.58 25.91,60.58 25.91,58.01 27.69,58.01 27.69,59.03 29.34,59.03 29.34,63.98
$2N1741 on Top Layer: 14.73,58.7 21.21,58.7 21.21,49.17 14.73,49.17
$2N2095 on Top Layer: 8.79,57.28 14.73,57.28 14.73,52.3 13.84,52.3 13.84,45.19 11.05,45.19 11.05,53.06 8.79,53.06
$2N9009 on Top Layer: 33.78,56.62 33.78,53.19 37.34,53.19 37.34,51.03 41.4,51.03 41.4,55.6 37.34,55.6 37.34,56.62

Small or netless copper shapes (teardrops, artwork), in the pictures only: 461 on Top Layer, 107 on Bottom Layer

## Text on the board
Bottom Silkscreen Layer: Halfapear | 2024.9.23 | 2024.9.23 JZB | 3V3 | KEY1 | KEY2 | GND | 5V | PA8 | PA9 | PA14_SWCLK | PA13_SWDIO | PC9 | PA10 | KEY3 | KEY4 | KEY5 | I2C3 | UART1 | CAN2_N | PB11 | CAN2_P | 供电拓展接口 | PB2 | PC12_TX | PB6_SCL | PB1 | PD2_RX | PB7_SDA | CAN1_N | I2C1 | CAN1_P | UART5 | PC5 | PC4 | PA6_MISO | PA15 | PA7_MOSI | SPI1 | PA5_SCK | USART2 | PA4_NSS | PC13_LS3 | PC15_LS1 | PC14_LS2 | USART4 | PA1_RX | PA2_TX | PB3_LS6 | PB5_LS4 | PB4_LS5 | PA3_RX | PA0_TX | I O | 五向开关 | 拓展引脚 | WIFI模块 / 方向向外 | 电磁阀控制接口 | STM32F405RGT6主控板 / V1.1 / horoscope / 2024/8/19 | VCC      GND
Top Silkscreen Layer: 复位 | CLK DIO G 3V3 | 3V3 | 灯 | 5V | G | IMU
